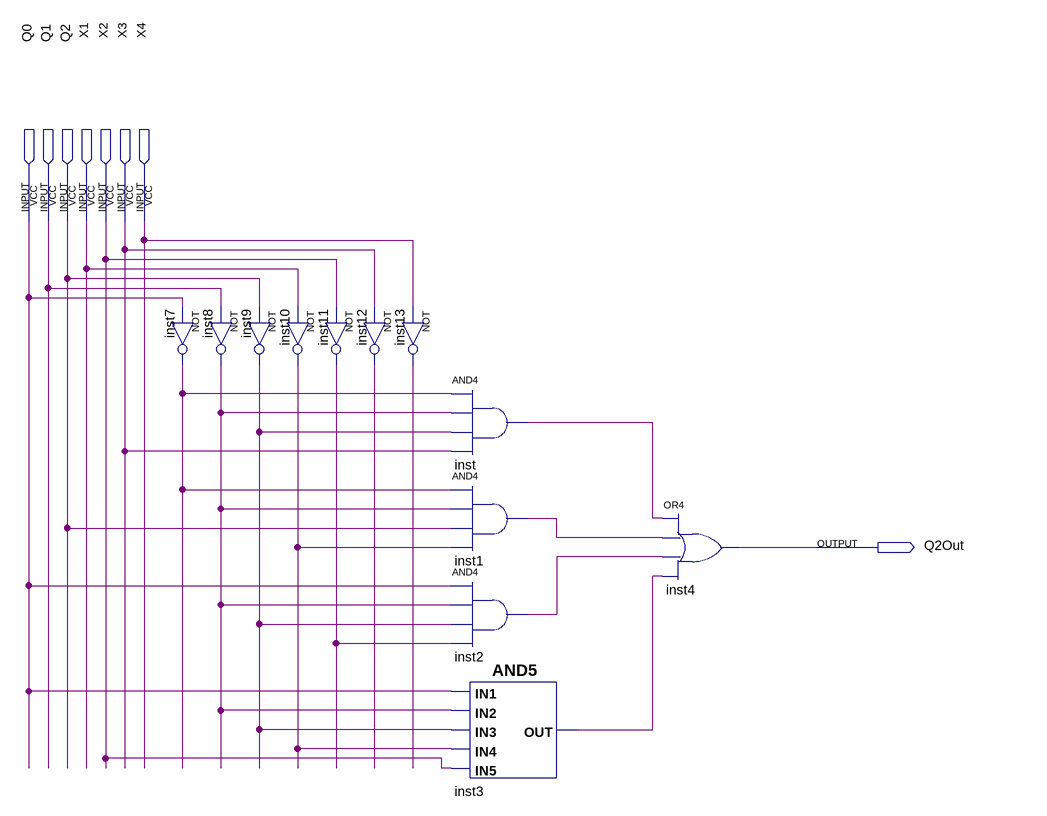
[diagram p0: schematic sheet]
// Quartus schematic Q2.bdf as structural Verilog: 12 symbols, 8 pins
module Q2 (
  input  Q0,
  input  Q1,
  input  Q2,
  input  X1,
  input  X2,
  input  X3,
  input  X4,
  output Q2Out
);

  wire inst1_out, inst2_out, inst3_out, inst7_out, inst8_out, inst9_out, inst10_out, inst11_out, inst12_out,
       inst13_out, inst_out;

  not inst7 (inst7_out, Q0);
  not inst8 (inst8_out, Q1);
  not inst9 (inst9_out, Q2);
  not inst10 (inst10_out, X1);
  not inst11 (inst11_out, X2);
  not inst12 (inst12_out, X3);
  not inst13 (inst13_out, X4);
  and inst (inst_out, inst7_out, inst8_out, inst9_out, X3);
  and inst1 (inst1_out, inst7_out, inst8_out, Q2, inst10_out);
  and inst2 (inst2_out, Q0, inst8_out, inst9_out, inst11_out);
  and inst3 (inst3_out, Q0, inst8_out, inst9_out, inst10_out, X2);
  or inst4 (Q2Out, inst_out, inst1_out, inst2_out, inst3_out);
endmodule
